# EAGLE design dtmf_trx (EAGLE 7.3.0)
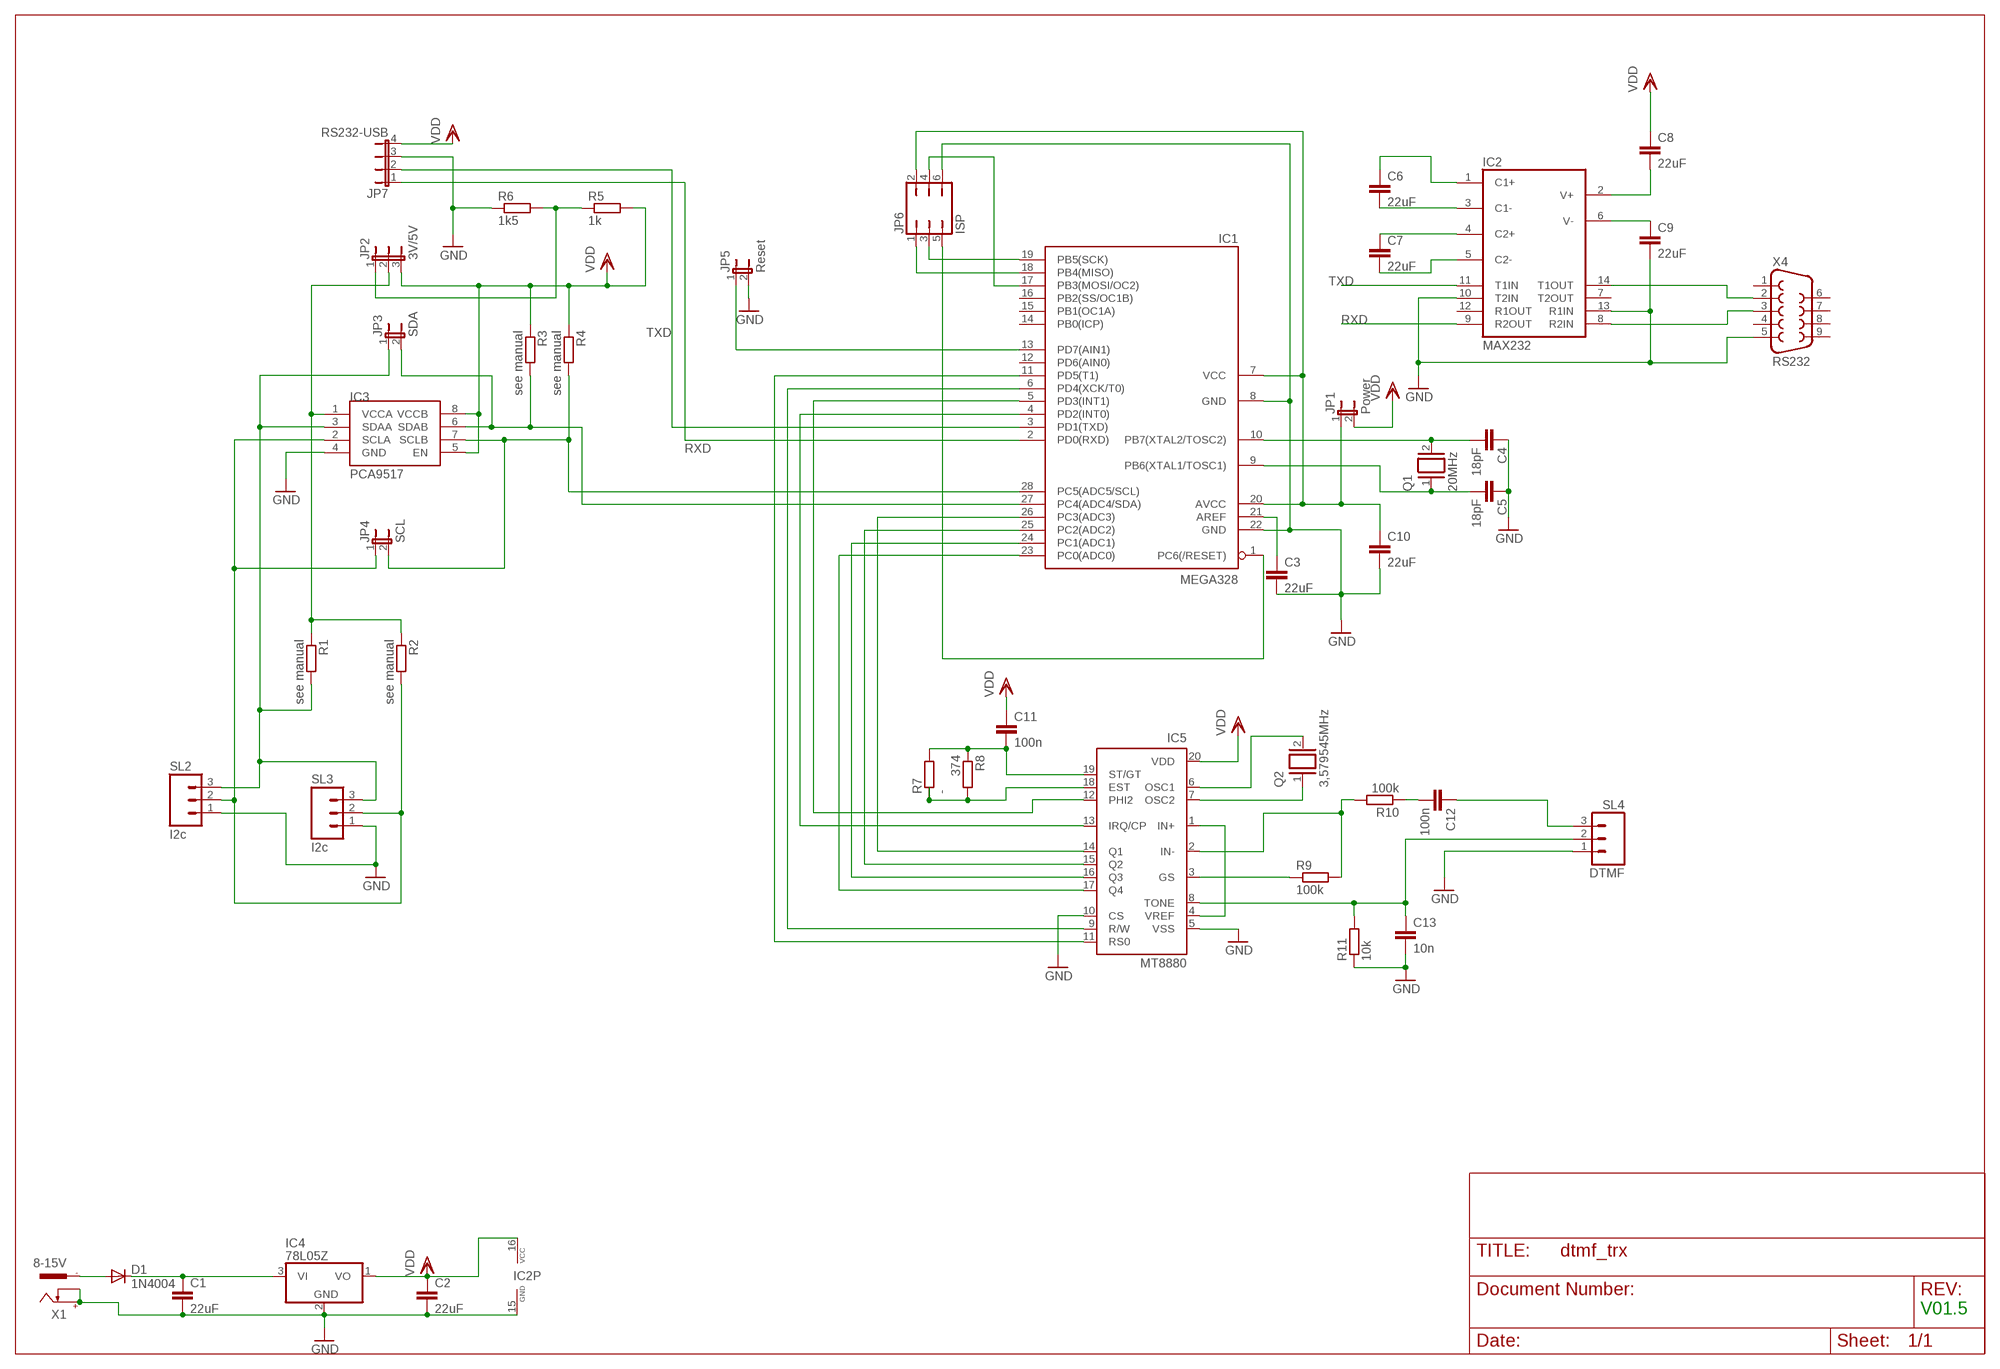
[diagram p0: schematic, sheet 1]

## Parts
C1  22uF  C-EUC1206  [C1206]
C2  22uF  C-EUC1206  [C1206]
C3  22uF  C-EUC1206  [C1206]
C4  18pF  C-EU025-025X050  [C025-025X050]
C5  18pF  C-EU025-025X050  [C025-025X050]
C6  22uF  C-EUC1206  [C1206]
C7  22uF  C-EUC1206  [C1206]
C8  22uF  C-EUC1206  [C1206]
C9  22uF  C-EUC1206  [C1206]
C10  22uF  C-EUC1206  [C1206]
C11  100n  C-EU050-025X075  [C050-025X075]
C12  100n  C-EU050-025X075  [C050-025X075]
C13  10n  C-EU050-025X075  [C050-025X075]
D1  1N4004  [DO41-10]
IC1  MEGA328  MEGA8-P  [DIL28-3]
IC2  MAX232  [DIL16]
IC3  PCA9517  [SO-08]
IC4  78L05Z  [TO92]
IC5  MT8880  [DIL20]
JP1  Power  JP1E  [JP1]
JP2  3V/5V  JP2E  [JP2]
JP3  SDA  JP1E  [JP1]
JP4  SCL  JP1E  [JP1]
JP5  Reset  JP1E  [JP1]
JP6  ISP  JP3Q  [JP3Q]
JP7  RS232-USB  JP4E  [JP4]
Q1  20MHz  XTAL/S  [QS]
Q2  3,579545MHz  XTAL/S  [QS]
R1  see manual  R-EU_R1206  [R1206]
R2  see manual  R-EU_R1206  [R1206]
R3  see manual  R-EU_R1206  [R1206]
R4  see manual  R-EU_R1206  [R1206]
R5  1k  R-EU_R1206  [R1206]
R6  1k5  R-EU_R1206  [R1206]
R7  -  R-EU_0309/V  [0309V]
R8  374  R-EU_0309/V  [0309V]
R9  100k  R-EU_R1206  [R1206]
R10  100k  R-EU_R1206  [R1206]
R11  10k  R-EU_R1206  [R1206]
SL2  I2c  M03  [03P]
SL3  I2c  M03  [03P]
SL4  DTMF  M03  [03P]
X1  8-15V  737992-55  [737992-5]
X4  RS232  F09H  [F09H]

## Nets
GND: C1.2 C2.2 C3.2 C4.1 C5.1 C9.2 C10.2 C13.2 IC1.8(GND) IC1.22(GND) IC2.10(T2IN) IC2.13(R1IN) IC2.15(GND) IC3.4(GND) IC4.2(GND) IC5.5(VSS) IC5.10(CS) JP5.2 JP6.6 JP7.3 R6.1 R11.1 SL2.1 SL3.1 SL4.1 X1.+ X1.K X4.5
N$2: IC1.11(PD5(T1)) IC5.11(RS0)
N$3: IC1.6(PD4(XCK/T0)) IC5.9(R/W)
N$4: IC1.4(PD2(INT0)) IC5.13(IRQ/CP)
N$5: IC1.27(PC4(ADC4/SDA)) IC3.6(SDAB) JP3.2 R3.2
N$6: IC1.13(PD7(AIN1)) JP5.1
N$7: D1.A X1.-1
N$8: IC1.23(PC0(ADC0)) IC5.17(Q4)
N$9: IC1.24(PC1(ADC1)) IC5.16(Q3)
N$10: IC1.25(PC2(ADC2)) IC5.15(Q2)
N$11: IC1.26(PC3(ADC3)) IC5.14(Q1)
N$12: IC1.5(PD3(INT1)) IC5.12(PHI2)
N$13: IC5.6(OSC1) Q2.2
N$14: IC5.7(OSC2) Q2.1
N$15: IC1.17(PB3(MOSI/OC2)) JP6.4
N$16: IC5.1(IN+) IC5.4(VREF)
N$17: C12.1 SL4.3
N$18: IC1.1(PC6(/RESET)) JP6.5
N$19: C4.2 IC1.10(PB7(XTAL2/TOSC2)) Q1.2
N$20: IC1.18(PB4(MISO)) JP6.1
N$21: C12.2 R10.1
N$22: IC3.2(SCLA) JP4.1 R2.2 SL2.2 SL3.2
N$23: JP2.1 R5.1 R6.2
N$24: IC5.2(IN-) R9.2 R10.2
N$25: C11.2 IC5.19(ST/GT) R7.2 R8.1
N$26: C5.2 IC1.9(PB6(XTAL1/TOSC1)) Q1.1
N$28: IC1.19(PB5(SCK)) JP6.3
N$29: IC5.3(GS) R9.1
N$30: C13.1 IC5.8(TONE) R11.2 SL4.2
N$31: IC5.18(EST) R7.1 R8.2
N$32: C3.1 IC1.21(AREF)
N$33: C1.1 D1.C IC4.3(VI)
N$34: C6.2 IC2.3(C1-)
N$36: C6.1 IC2.1(C1+)
N$37: IC3.1(VCCA) JP2.2 R1.1 R2.1
N$38: C7.1 IC2.4(C2+)
N$39: C7.2 IC2.5(C2-)
N$40: IC2.8(R2IN) X4.3
N$41: IC3.3(SDAA) JP3.1 R1.2 SL2.3 SL3.3
N$42: IC1.28(PC5(ADC5/SCL)) IC3.7(SCLB) JP4.2 R4.2
N$43: IC2.14(T1OUT) X4.2
N$45: C9.1 IC2.6(V-)
N$46: C8.2 IC2.2(V+)
N$58: C10.1 IC1.7(VCC) IC1.20(AVCC) JP1.1 JP6.2
RXD: IC1.2(PD0(RXD)) IC2.9(R2OUT) JP7.1
TXD: IC1.3(PD1(TXD)) IC2.11(T1IN) JP7.2
VDD: C2.1 C8.1 C11.1 IC2.16(VCC) IC3.5(EN) IC3.8(VCCB) IC4.1(VO) IC5.20(VDD) JP1.2 JP2.3 JP7.4 R3.1 R4.1 R5.2
Unconnected: IC1.12(PD6(AIN0)) IC1.14(PB0(ICP)) IC1.15(PB1(OC1A)) IC1.16(PB2(SS/OC1B)) IC2.7(T2OUT) IC2.12(R1OUT) X1.-2 X4.1 X4.4 X4.6 X4.7 X4.8 X4.9

## Notes on the sheet
- V01.5

## Library data of the parts
C1-C3 C6-C10 = rcl:C-EU: CAPACITOR, European symbol
C4 C5 C11-C13 = resistor:C-EU: CAPACITOR, European symbol
D1 = diode:1N4004: DIODE general purpose rectifier, 1 A
IC1 = atmel:MEGA8-P: MICROCONTROLLER 8 Kbytes FLASH, 1 kbytes SRAM, 512 bytes EEPROM, USART, 4-channel 10 bit ADC, 2-channel 8 bit ADC Pin compatible with Atmega48, ATMega88, ATMega168 Source: avr.lbr; OC_FARNELL: unknown; OC_NEWARK: unknown
IC2 = maxim:MAX232: RS232 TRANSCEIVER; MF: MAXIM; MPN: MAX232ACPE+; OC_FARNELL: 9723773; OC_NEWARK: 68K4544
IC3 = PCA9517:PCA9517: PCA9517
IC4 = linear:78*: Positive VOLTAGE REGULATOR Source: http://cache.national.com/ds/LM/LM78L05.pdf http://www.fairchildsemi.com/ds/LM/LM7805.pdf
IC5 = dk1ri:MT8880
JP1 JP3-JP5 = jumper:JP1E: JUMPER
JP2 = jumper:JP2E: JUMPER
JP6 = jumper:JP3Q: JUMPER
JP7 = jumper:JP4E: JUMPER
Q1 Q2 = special:XTAL/S: CRYSTAL
R1-R11 = resistor:R-EU_: RESISTOR, European symbol
SL2-SL4 = con-amp-quick:M03: AMP QUICK CONNECTOR; OC_FARNELL: unknown; OC_NEWARK: unknown
X1 = con-conrad:737992-55: FEMALE PRINT CONNECTOR DIN 45323 (34V/3A), ROKA, distributor Conrad
X4 = con-subd:F09: SUB-D; OC_FARNELL: unknown; OC_NEWARK: unknown

## Board
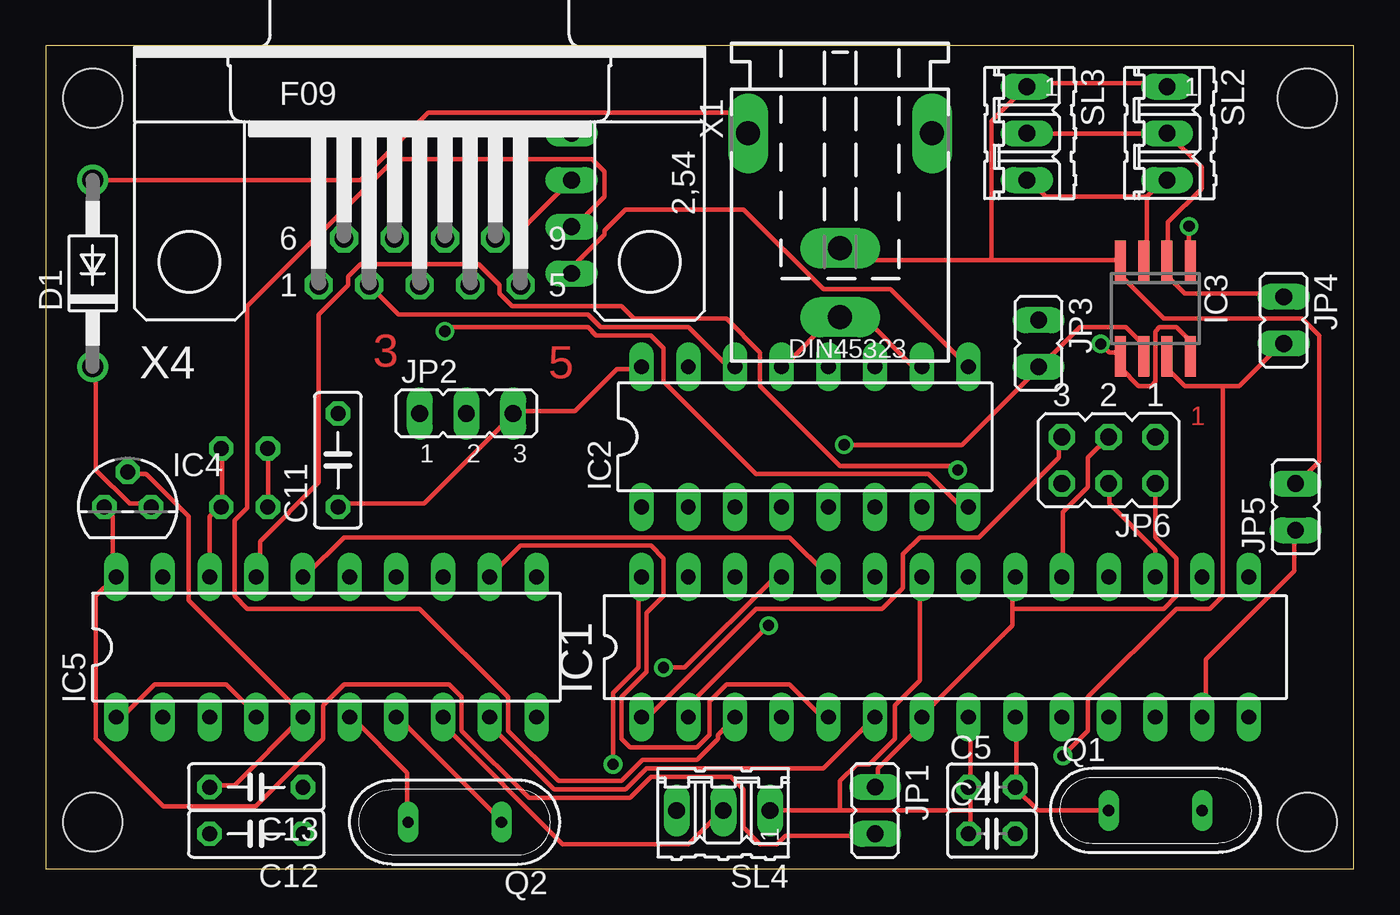
[diagram p1: board, top side]
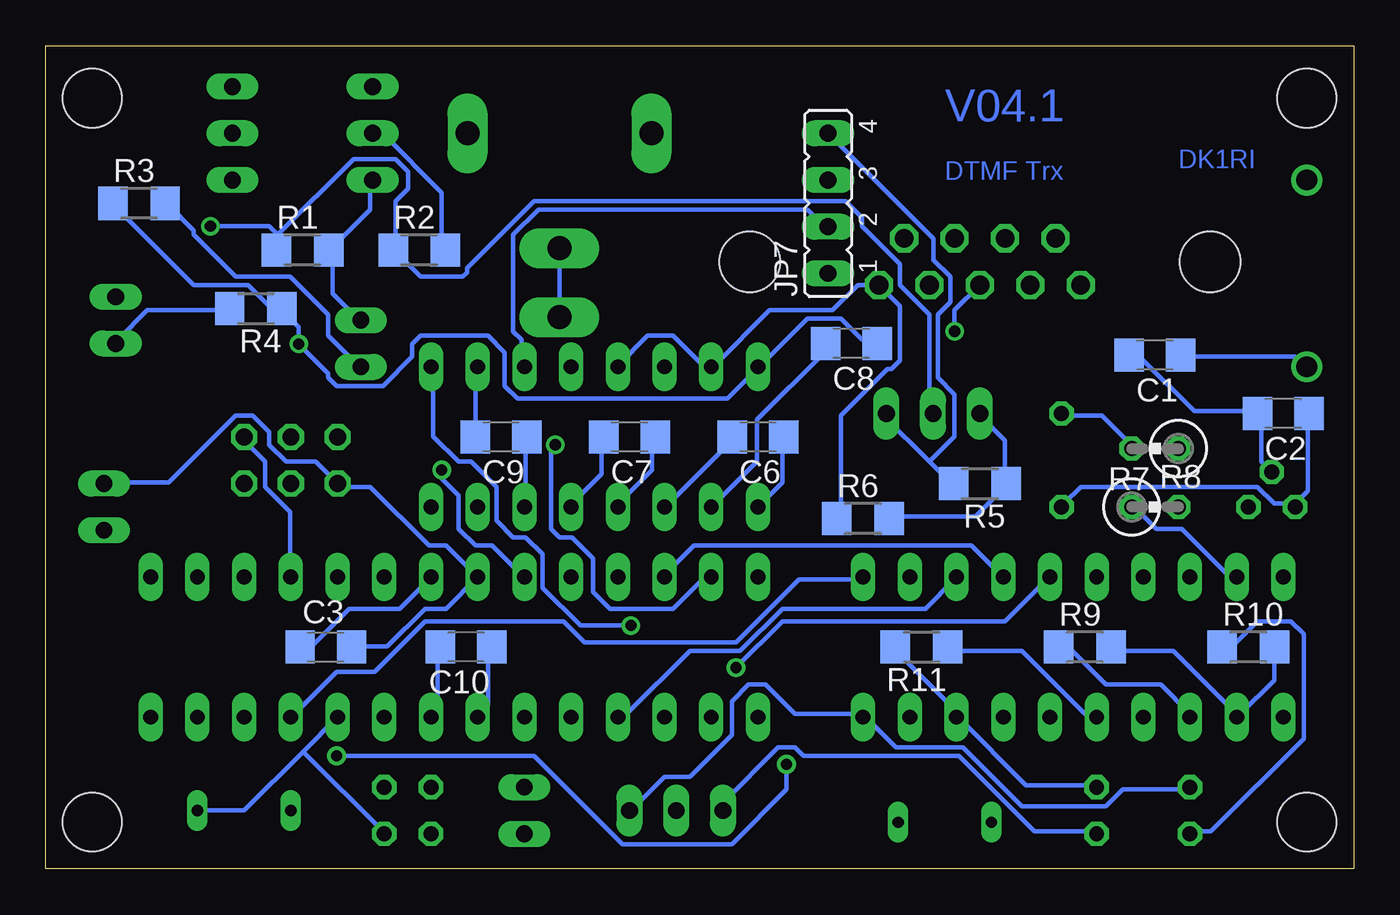
[diagram p2: board, bottom side, seen from below]

Size 71.1 x 44.75 mm. Coordinates in mm from the lower left corner, seen from the top.
Outline: 0,0 71.1,0 71.1,44.75 0,44.75 0,0
Copper layers (1*16): Top 0.035mm / dielectric 1.5mm / Bottom 0.035mm
Design rules "default": minimum track width 10mil, minimum drill 24mil, track to track 8mil, track to pad 8mil, pad to pad 8mil, via to via 8mil, smd to smd 8mil, copper to edge 40mil, drill to drill 8mil, minimum pad ring 10mil, minimum via ring 8mil, stop-mask expansion 4mil, vias tented up to drill 0mil, thermal gap 10mil
Holes 3.2 mm at 68.58,41.91 68.58,2.54 2.54,41.91 2.54,2.54

### Footprints (pad centres in the part's own frame; a part is rotated, then mirrored left to right if it is on the bottom)
C1206 = smd 1.6 x 1.8: 1 -1.4,0; 2 1.4,0
C025-025X050 = drill 0.813 octagon: 1 -1.27,0; 2 1.27,0
C050-025X075 = drill 0.813 octagon: 1 -2.54,0; 2 2.54,0
DO41-10 = drill 1.118: A 5.08,0; C -5.08,0
DIL28-3 = drill 0.813 long: 1 -16.51,-3.81; 2 -13.97,-3.81; 3 -11.43,-3.81; 4 -8.89,-3.81; 5 -6.35,-3.81; 6 -3.81,-3.81; 7 -1.27,-3.81; 8 1.27,-3.81; 9 3.81,-3.81; 10 6.35,-3.81; 11 8.89,-3.81; 12 11.43,-3.81; 13 13.97,-3.81; 14 16.51,-3.81; 15 16.51,3.81; 16 13.97,3.81; 17 11.43,3.81; 18 8.89,3.81; 19 6.35,3.81; 20 3.81,3.81; 21 1.27,3.81; 22 -1.27,3.81; 23 -3.81,3.81; 24 -6.35,3.81; 25 -8.89,3.81; 26 -11.43,3.81; 27 -13.97,3.81; 28 -16.51,3.81
DIL16 = drill 0.813 long: 1 -8.89,-3.81; 2 -6.35,-3.81; 3 -3.81,-3.81; 4 -1.27,-3.81; 5 1.27,-3.81; 6 3.81,-3.81; 7 6.35,-3.81; 8 8.89,-3.81; 9 8.89,3.81; 10 6.35,3.81; 11 3.81,3.81; 12 1.27,3.81; 13 -1.27,3.81; 14 -3.81,3.81; 15 -6.35,3.81; 16 -8.89,3.81
SO-08 = smd 0.6 x 2.2: 1 -1.905,-2.6; 2 -0.635,-2.6; 3 0.635,-2.6; 4 1.905,-2.6; 5 1.905,2.6; 6 0.635,2.6; 7 -0.635,2.6; 8 -1.905,2.6
TO92 = drill 0.813 octagon: 1 -1.27,0; 2 0,1.905; 3 1.27,0
DIL20 = drill 0.813 long: 1 -11.43,-3.81; 2 -8.89,-3.81; 3 -6.35,-3.81; 4 -3.81,-3.81; 5 -1.27,-3.81; 6 1.27,-3.81; 7 3.81,-3.81; 8 6.35,-3.81; 9 8.89,-3.81; 10 11.43,-3.81; 11 11.43,3.81; 12 8.89,3.81; 13 6.35,3.81; 14 3.81,3.81; 15 1.27,3.81; 16 -1.27,3.81; 17 -3.81,3.81; 18 -6.35,3.81; 19 -8.89,3.81; 20 -11.43,3.81
JP1 = drill 0.914 long: 1 0,-1.27; 2 0,1.27
JP2 = drill 0.914 long: 1 -2.54,0; 2 0,0; 3 2.54,0
JP3Q = drill 0.914 octagon: 1 -2.54,-1.27; 2 -2.54,1.27; 3 0,-1.27; 4 0,1.27; 5 2.54,-1.27; 6 2.54,1.27
JP4 = drill 0.914 long: 1 -3.81,0; 2 -1.27,0; 3 1.27,0; 4 3.81,0
QS = drill 0.61 long: 1 -2.54,0; 2 2.54,0
R1206 = smd 1.6 x 1.803: 1 -1.422,0; 2 1.422,0
0309V = drill 0.813 octagon: 1 -1.27,0; 2 1.27,0
03P = drill 0.914 long: 1 -2.54,0; 2 0,0; 3 2.54,0
737992-5 = drill 1.3 pad 2.184 long: + 0,10; -1 5,0; -2 -5,0; K 0,6.25
F09H = drill 1.016 octagon: 1 -5.486,-1.27; 2 -2.743,-1.27; 3 0,-1.27; 4 2.743,-1.27; 5 5.486,-1.27; 6 -4.115,1.27; 7 -1.372,1.27; 8 1.372,1.27; 9 4.115,1.27 | hole 3.302: -12.522,0; 12.522,0

### Placement (x,y rotation side)
C1  10.79,27.94 180 bottom
C2  3.81,24.77 180 bottom
C3  55.88,12.06 0 bottom
C4  51.44,1.9 0 top
C5  51.44,4.44 0 top
C6  32.38,23.49 180 bottom
C7  39.37,23.49 180 bottom
C8  27.3,28.57 180 bottom
C9  46.36,23.49 180 bottom
C10  48.26,12.06 180 bottom
C11  15.87,22.23 90 top
C12  11.43,1.9 180 top
C13  11.43,4.44 180 top
D1  2.54,32.38 90 top
IC1  48.9,12.06 0 top
IC2  41.27,23.49 0 top
IC3  60.33,30.48 180 top
IC4  4.44,19.69 0 top
IC5  15.24,12.06 0 top
JP1  45.09,3.17 180 top
JP2  22.86,24.77 0 top
JP3  53.97,28.57 180 top
JP4  67.31,29.84 180 top
JP5  67.95,19.69 0 top
JP6  57.78,22.23 180 top
JP7  28.58,36.2 90 bottom
Q1  60.33,3.17 0 top
Q2  22.23,2.54 180 top
R1  57.15,33.65 0 bottom
R2  50.8,33.65 0 bottom
R3  66.04,36.2 0 bottom
R4  59.69,30.48 180 bottom
R5  20.32,20.95 180 bottom
R6  26.67,19.05 0 bottom
R7  10.79,22.86 180 bottom
R8  10.79,19.69 0 bottom
R9  14.6,12.06 0 bottom
R10  5.71,12.06 0 bottom
R11  23.5,12.06 180 bottom
SL2  60.96,40 270 top
SL3  53.34,40 270 top
SL4  36.83,3.17 180 top
X1  43.18,40 180 top
X4  20.32,33.02 0 top

### Tracks (layer width: path | path; a pad name or v marks a point on that pad's centre or on a via)
GND
  Top 0.254: X4.5 25.81,34.72 28.55,37.46 JP7.3 | 43.18,29.92 44.55,29.92 47.07,27.41 47.52,27.41 IC2.10 | 43.18,29.92 42.72,29.92 40.21,27.41 IC2.13 | 43.18,29.92 X1.+ | SL2.1 60.78,42.72 53.47,42.72 SL3.1 53.24,42.49 51.41,40.66 51.41,33.12 | 51.41,33.12 43.64,33.12 43.18,33.58 X1.K | 51.41,33.12 58.27,33.12 IC3.4 58.5,32.89 58.5,32.21 60.78,29.92 68.33,29.92 69.24,29.01 69.24,22.15 68.1,21.01 JP5.2 | C13.2 8.89,4.55 10.26,4.55 IC5.5 13.92,8.43 7.75,14.6 7.75,19.18 5.46,21.46 4.55,21.46 IC4.2 | 50.27,3.17 50.27,4.32 C5.1 50.27,4.55 50.27,8.2 IC1.8 | 50.27,3.17 50.27,2.03 C4.1 | SL4.1 43.18,3.17 | 43.18,3.17 50.27,3.17 | 43.18,3.17 43.18,4.77 44.09,5.69 44.78,5.69 46.15,7.06 46.15,8.89 47.52,10.26 47.52,15.75 IC1.22
  Bottom 0.254: R6.1 27.86,19.18 27.86,24.66 25.35,27.18 25.12,27.18 24.66,27.63 24.66,30.61 X4.5 26.95,31.75 28.32,30.38 31.75,30.38 34.72,27.41 IC2.15 34.95,27.41 35.41,27.41 37.01,29.01 38.38,29.01 39.98,27.41 IC2.13 | C9.2 47.75,23.52 47.75,27.18 IC2.10 | X1.K X1.+ | IC4.2 5,22.15 5,24.66 C2.2 5.23,24.89 8.66,24.89 11.63,27.86 12.09,27.86 C1.2 | R11.1 21.92,11.86 18.03,11.86 14.6,8.43 14.15,8.43 IC5.5 | C3.2 54.38,12.09 52.55,12.09 50.5,14.15 49.35,14.15 IC1.22 47.75,15.98 49.35,17.58 50.27,17.58 53.47,20.78 55.07,20.78 JP6.6 56.44,22.15 58.04,22.15 58.95,23.06 58.95,23.75 59.87,24.66 60.78,24.66 64.44,21.01 67.87,21.01 JP5.2 | C10.2 49.81,11.86 49.81,8.66 50.04,8.43 IC1.8 | SL4.1 39.29,3.17 37.47,5 36.09,5 33.81,7.29 33.81,9.12 32.89,10.03 31.98,10.03 30.38,8.43 26.72,8.43 IC5.10 26.49,8.2 24.89,6.6 21.23,6.6 18.03,3.4 13.46,3.4 12.55,4.32 8.89,4.32 C13.2
N$2
  Bottom 0.254: IC1.11 57.58,8.43 55.3,10.72 53.24,10.72 50.5,13.46 42.95,13.46 41.81,12.32 33.58,12.32 30.15,15.75 26.72,15.75 IC5.11
N$3
  Top 0.254: IC5.9 24.21,8.2 24.21,7.75 27.63,4.32 31.52,4.32 32.66,5.46 42.27,5.46 45.01,8.2 IC1.6
N$4
  Bottom 0.254: IC1.4 39.98,8.43 39.52,8.43 36.09,11.86 33.35,11.86 31.06,14.15 23.29,14.15 21.69,15.75 IC5.13
N$5  (via drill 0.61)
  Top 0.254: IC3.6 59.64,28.09 59.64,28.55 58.72,29.46 56.21,29.46 54.15,27.41 JP3.2 53.92,27.18 49.81,23.06 v43.41,23.06
  Bottom 0.254: R3.2 64.44,36.09 63.07,34.72 63.07,34.49 60.78,32.21 57.81,32.21 55.75,30.15 55.75,29.01 54.15,27.41 JP3.2 | v43.41,23.06 43.64,22.84 43.64,18.49 43.18,18.03 42.49,18.03 41.35,16.89 41.35,15.06 40.44,14.15 37.01,14.15 35.41,15.75 34.95,15.75 IC1.27
N$6
  Top 0.254: IC1.13 63.07,8.43 63.07,11.4 67.87,16.2 67.87,18.26 JP5.1
N$7
  Top 0.254: D1.A 17.12,37.46 20.78,41.12 37.24,41.12 38.15,40.21 X1.-1
N$8  (via drill 0.61)
  Top 0.254: v49.58,21.69 49.35,21.92 43.18,21.92 38.84,26.26 38.84,28.09 37.01,29.92 31.98,29.92 31.29,30.61 25.35,30.61 24.66,31.29 24.66,31.75 23.52,32.89 17.12,32.89 16.43,32.21 16.43,31.75 14.83,30.15 14.83,21.01 11.63,17.8 11.63,15.98 IC5.17
  Bottom 0.254: v49.58,21.69 49.58,21.23 48.67,20.32 48.67,18.49 47.75,17.58 46.84,17.58 45.24,15.98 IC1.23
N$9
  Top 0.254: IC5.16 14.15,15.98 16.2,18.03 40.44,18.03 42.49,15.98 IC1.24
N$10  (via drill 0.61)
  Top 0.254: v33.58,10.95 34.72,10.95 39.52,15.75 39.98,15.75 IC1.25
  Bottom 0.254: v33.58,10.95 31.06,13.46 18.95,13.46 16.66,15.75 IC5.15
N$11
  Bottom 0.254: IC5.14 19.18,15.98 20.78,17.58 35.87,17.58 37.47,15.98 IC1.26
N$12
  Top 0.254: IC1.5 42.49,8.43 42.04,8.43 40.44,10.03 37.01,10.03 36.09,9.12 36.09,7.29 35.41,6.6 31.75,6.6 31.29,7.06 31.29,9.35 32.66,10.72 32.66,13.92 33.58,14.83 33.58,16.89 32.89,17.58 25.81,17.58 24.21,15.98 IC5.12
N$13
  Top 0.254: Q2.2 19.63,2.72 19.63,5.23 16.66,8.2 IC5.6
N$14
  Top 0.254: Q2.1 24.66,2.72 19.18,8.2 IC5.7
N$15
  Top 0.254: IC1.17 60.33,17.35 57.81,19.86 57.81,20.78 JP6.4
N$16
  Top 0.254: IC5.1 3.86,8.43 4.32,8.43 5.92,10.03 9.8,10.03 11.4,8.43 IC5.4
N$17
  Bottom 0.254: C12.1 14.15,2.03 17.35,2.03 21.46,6.15 29.92,6.15 30.38,6.6 31.29,6.6 34.27,3.63 34.27,3.17 SL4.3
N$18
  Top 0.254: IC1.1 32.44,8.43 32.89,8.43 38.61,14.15 45.47,14.15 46.61,15.29 46.61,17.12 47.52,18.03 50.72,18.03 55.07,22.38 55.07,23.29 JP6.5
N$19
  Bottom 0.254: Q1.2 60.33,3.17 57.12,6.38 | IC1.10 57.12,6.38 | 57.12,6.38 52.78,2.03 C4.2
N$20
  Bottom 0.254: IC1.18 57.81,15.98 57.81,19.41 59.18,20.78 59.18,22.15 60.33,23.29 JP6.1
N$21
  Bottom 0.254: R10.1 7.06,12.09 6.6,12.09 5.23,13.46 3.4,13.46 2.72,12.78 2.72,7.06 7.75,2.03 8.89,2.03 C12.2
N$22
  Top 0.254: JP4.1 67.18,31.29 61.92,31.29 61.01,32.21 61.01,32.89 IC3.2 61.01,33.12 61.01,35.18 62.84,37.01 62.84,38.15 61.01,39.98 SL2.2 60.78,39.98 53.47,39.98 SL3.2
  Bottom 0.254: R2.2 49.58,33.81 49.58,36.78 52.78,39.98 53.24,39.98 SL3.2
N$23
  Bottom 0.254: JP2.1 20.32,24.66 18.95,23.29 18.95,21.01 R5.1 18.95,20.78 20.55,19.18 25.12,19.18 R6.2
N$24
  Bottom 0.254: R10.2 4.32,11.86 4.32,10.26 6.15,8.43 IC5.2 6.37,8.43 9.8,11.86 13.01,11.86 R9.2
N$25
  Top 0.254: R7.2 12.09,22.84 12.09,19.86 R8.1
  Bottom 0.254: IC5.19 6.37,15.98 6.83,15.98 9.35,18.49 10.72,18.49 11.86,19.63 R8.1 | C11.2 15.75,24.66 13.69,24.66 12.09,23.06 R7.2
N$26
  Top 0.254: Q1.1 53.92,3.17 52.78,4.32 C5.2 52.78,4.55 52.78,8.2 IC1.9
N$28
  Top 0.254: JP6.3 56.67,22.38 56.67,20.78 55.3,19.41 55.3,15.98 IC1.19
N$29
  Bottom 0.254: R9.1 15.98,11.86 15.29,11.86 13.46,10.03 10.49,10.03 8.89,8.43 IC5.3
N$30
  Top 0.254: SL4.2 36.78,3.17 34.95,1.35 28.09,1.35 21.69,7.75 21.69,8.2 IC5.8
  Bottom 0.254: R11.2 24.89,11.86 21.46,8.43 IC5.8 21.46,8.2 17.8,4.55 14.15,4.55 C13.1
N$31
  Top 0.254: IC5.18 8.89,19.18 9.35,19.63 R8.2 9.58,19.86 9.58,22.84 R7.1
N$32
  Bottom 0.254: C3.1 57.12,12.09 56.67,12.09 54.61,14.15 51.87,14.15 50.27,15.75 IC1.21
N$33
  Top 0.254: IC4.3 5.69,19.86 4.55,19.86 2.72,21.69 2.72,27.18 D1.C
  Bottom 0.254: C1.1 9.35,27.86 3.17,27.86 2.72,27.41 D1.C
N$34
  Bottom 0.254: C6.2 33.81,23.29 37.47,19.63 IC2.3
N$36
  Bottom 0.254: IC2.1 31.06,21.01 31.06,23.29 C6.1
N$37  (via drill 0.61)
  Top 0.254: v62.15,34.95 62.15,33.12 IC3.1
  Bottom 0.254: 58.5,34.49 54.38,38.61 52.09,38.61 51.41,37.92 51.41,37.01 52.09,36.32 52.09,33.81 R2.1 52.09,33.58 50.72,32.21 48.44,32.21 48.21,32.44 48.21,32.66 44.55,36.32 27.63,36.32 26.72,35.41 26.72,34.95 24.66,32.89 24.66,31.75 23.06,30.15 23.06,24.89 JP2.2 | 58.5,34.49 58.5,33.81 R1.1 58.5,34.49 | v62.15,34.95 58.95,34.95 58.5,34.49
N$38
  Bottom 0.254: C7.1 38.15,23.29 38.15,21.69 39.98,19.86 IC2.4
N$39
  Bottom 0.254: C7.2 40.89,23.29 40.89,21.46 42.49,19.86 IC2.5
N$40  (via drill 0.61)
  Top 0.254: v21.69,29.23 21.92,29.46 29.46,29.46 29.92,29.01 32.89,29.01 33.58,28.32 33.58,26.49 38.61,21.46 47.98,21.46 49.58,19.86 50.04,19.86 IC2.8
  Bottom 0.254: v21.69,29.23 21.69,30.38 X4.3
N$41
  Top 0.254: 59.87,36.55 59.87,33.12 IC3.3 | 59.87,36.55 60.78,37.46 SL2.3 | 59.87,36.55 54.38,36.55 53.47,37.46 SL3.3
  Bottom 0.254: JP3.1 54.15,29.92 55.52,31.29 55.52,33.58 R1.2 55.52,33.81 53.47,35.86 53.47,37.46 SL3.3
N$42  (via drill 0.61)
  Top 0.254: 63.98,26.26 64.9,26.26 67.18,28.55 JP4.2 | 63.98,26.26 61.92,26.26 61.01,27.18 61.01,27.86 IC3.7 | v30.84,5.69 30.84,9.58 32.21,10.95 32.21,15.75 IC1.28 | v55.3,6.15 56.67,7.52 56.67,9.35 61.47,14.15 63.3,14.15 63.98,14.83 63.98,26.26
  Bottom 0.254: R4.2 61.24,30.38 65.58,30.38 67.18,28.78 JP4.2 | v30.84,5.69 30.84,4.32 33.81,1.35 39.75,1.35 44.55,6.15 v55.3,6.15
N$43
  Top 0.254: X4.2 19.18,30.15 29.46,30.15 30.15,29.46 34.95,29.46 37.01,27.41 37.47,27.41 IC2.14
N$45
  Bottom 0.254: C9.1 45.01,23.29 45.01,19.86 IC2.6
N$46
  Bottom 0.254: C8.2 28.78,28.55 28.78,28.09 32.44,24.43 32.44,22.15 34.72,19.86 IC2.2
N$58
  Top 0.254: 52.55,14.15 52.55,13.23 47.75,8.43 IC1.7 47.52,8.2 47.52,7.75 45.24,5.46 45.24,4.55 JP1.1 | 52.55,14.15 52.55,15.75 IC1.20 | JP6.2 60.33,18.03 61.47,16.89 61.47,14.83 60.78,14.15 52.55,14.15
  Bottom 0.254: C10.1 47.07,11.86 47.07,8.89 47.52,8.43 IC1.7
RXD  (via drill 0.61)
  Top 0.254: v39.29,13.23 34.95,8.89 34.95,8.43 IC1.2 | JP7.1 28.78,32.44 28.78,32.89 30.38,34.49 30.38,34.72 31.52,35.86 37.92,35.86 42.27,31.52 45.92,31.52 50.04,27.41 IC2.9
  Bottom 0.254: v39.29,13.23 42.04,13.23 44.09,15.29 44.09,17.12 45.01,18.03 45.7,18.03 46.61,18.95 46.61,20.78 47.98,22.15 48.67,22.15 50.04,23.52 50.04,27.18 IC2.9
TXD
  Top 0.254: IC1.3 37.47,8.2 36.55,7.29 36.55,7.06 35.41,5.92 32.44,5.92 31.29,4.77 27.86,4.77 25.12,7.52 25.12,9.35 20.32,14.15 10.95,14.15 10.26,14.83 10.26,18.95 10.95,19.63 10.95,30.61 18.95,38.61 29.69,38.61 30.38,37.92 30.38,36.55 28.78,34.95 JP7.2
  Bottom 0.254: IC2.11 45.24,27.41 45.24,28.78 45.7,29.23 45.7,34.49 44.32,35.86 29.69,35.86 28.78,34.95 JP7.2
VDD  (via drill 0.61)
  Top 0.254: IC4.1 3.17,19.63 3.63,19.18 3.63,15.98 IC5.20 3.63,15.75 2.72,14.83 2.72,7.06 6.37,3.4 11.4,3.4 15.06,7.06 15.06,8.89 16.2,10.03 21.92,10.03 22.61,9.35 22.61,7.52 26.26,3.86 31.75,3.86 32.89,5 37.24,5 37.92,4.32 37.92,2.26 38.84,1.35 39.75,1.35 40.21,1.8 45.01,1.8 JP1.2 | IC3.8 62.15,28.09 62.15,28.78 61.47,29.46 60.55,29.46 60.33,29.23 60.33,26.49 60.1,26.26 59.41,26.26 58.5,27.18 58.5,27.86 IC3.5 58.27,28.09 57.81,28.09 v57.35,28.55 | C11.1 15.98,19.86 20.55,19.86 25.35,24.66 JP2.3 25.58,24.89 28.78,24.89 31.06,27.18 32.21,27.18 IC2.16
  Bottom 0.254: 3.17,19.86 2.49,20.55 2.49,24.66 C2.1 | R3.1 67.41,36.09 63.07,31.75 60.1,31.75 58.95,30.61 58.5,30.61 R4.1 58.27,30.38 57.35,29.46 v57.35,28.55 55.75,26.95 55.75,26.72 55.3,26.26 52.78,26.26 51.18,27.86 51.18,28.55 50.72,29.01 47.07,29.01 46.15,28.09 46.15,26.26 45.47,25.58 34.04,25.58 32.44,27.18 IC2.16 32.21,27.41 29.69,29.92 27.86,29.92 26.72,28.78 26.04,28.78 C8.1 | 23.06,22.15 25.58,24.66 JP2.3 | 23.06,22.15 21.92,21.01 R5.2 | JP7.4 22.84,34.27 22.84,33.12 21.92,32.21 21.92,30.84 22.61,30.15 22.61,26.72 21.69,25.81 21.69,23.52 23.06,22.15 | 3.17,19.86 4.32,19.86 5.23,20.78 14.83,20.78 15.75,19.86 C11.1 | 3.17,19.86 IC4.1

### Text on the board
Top: 3 | 5 | 1
Bottom: V04.1 | DK1RI | DTMF Trx